# Altium project PCB_Project.PrjPcb
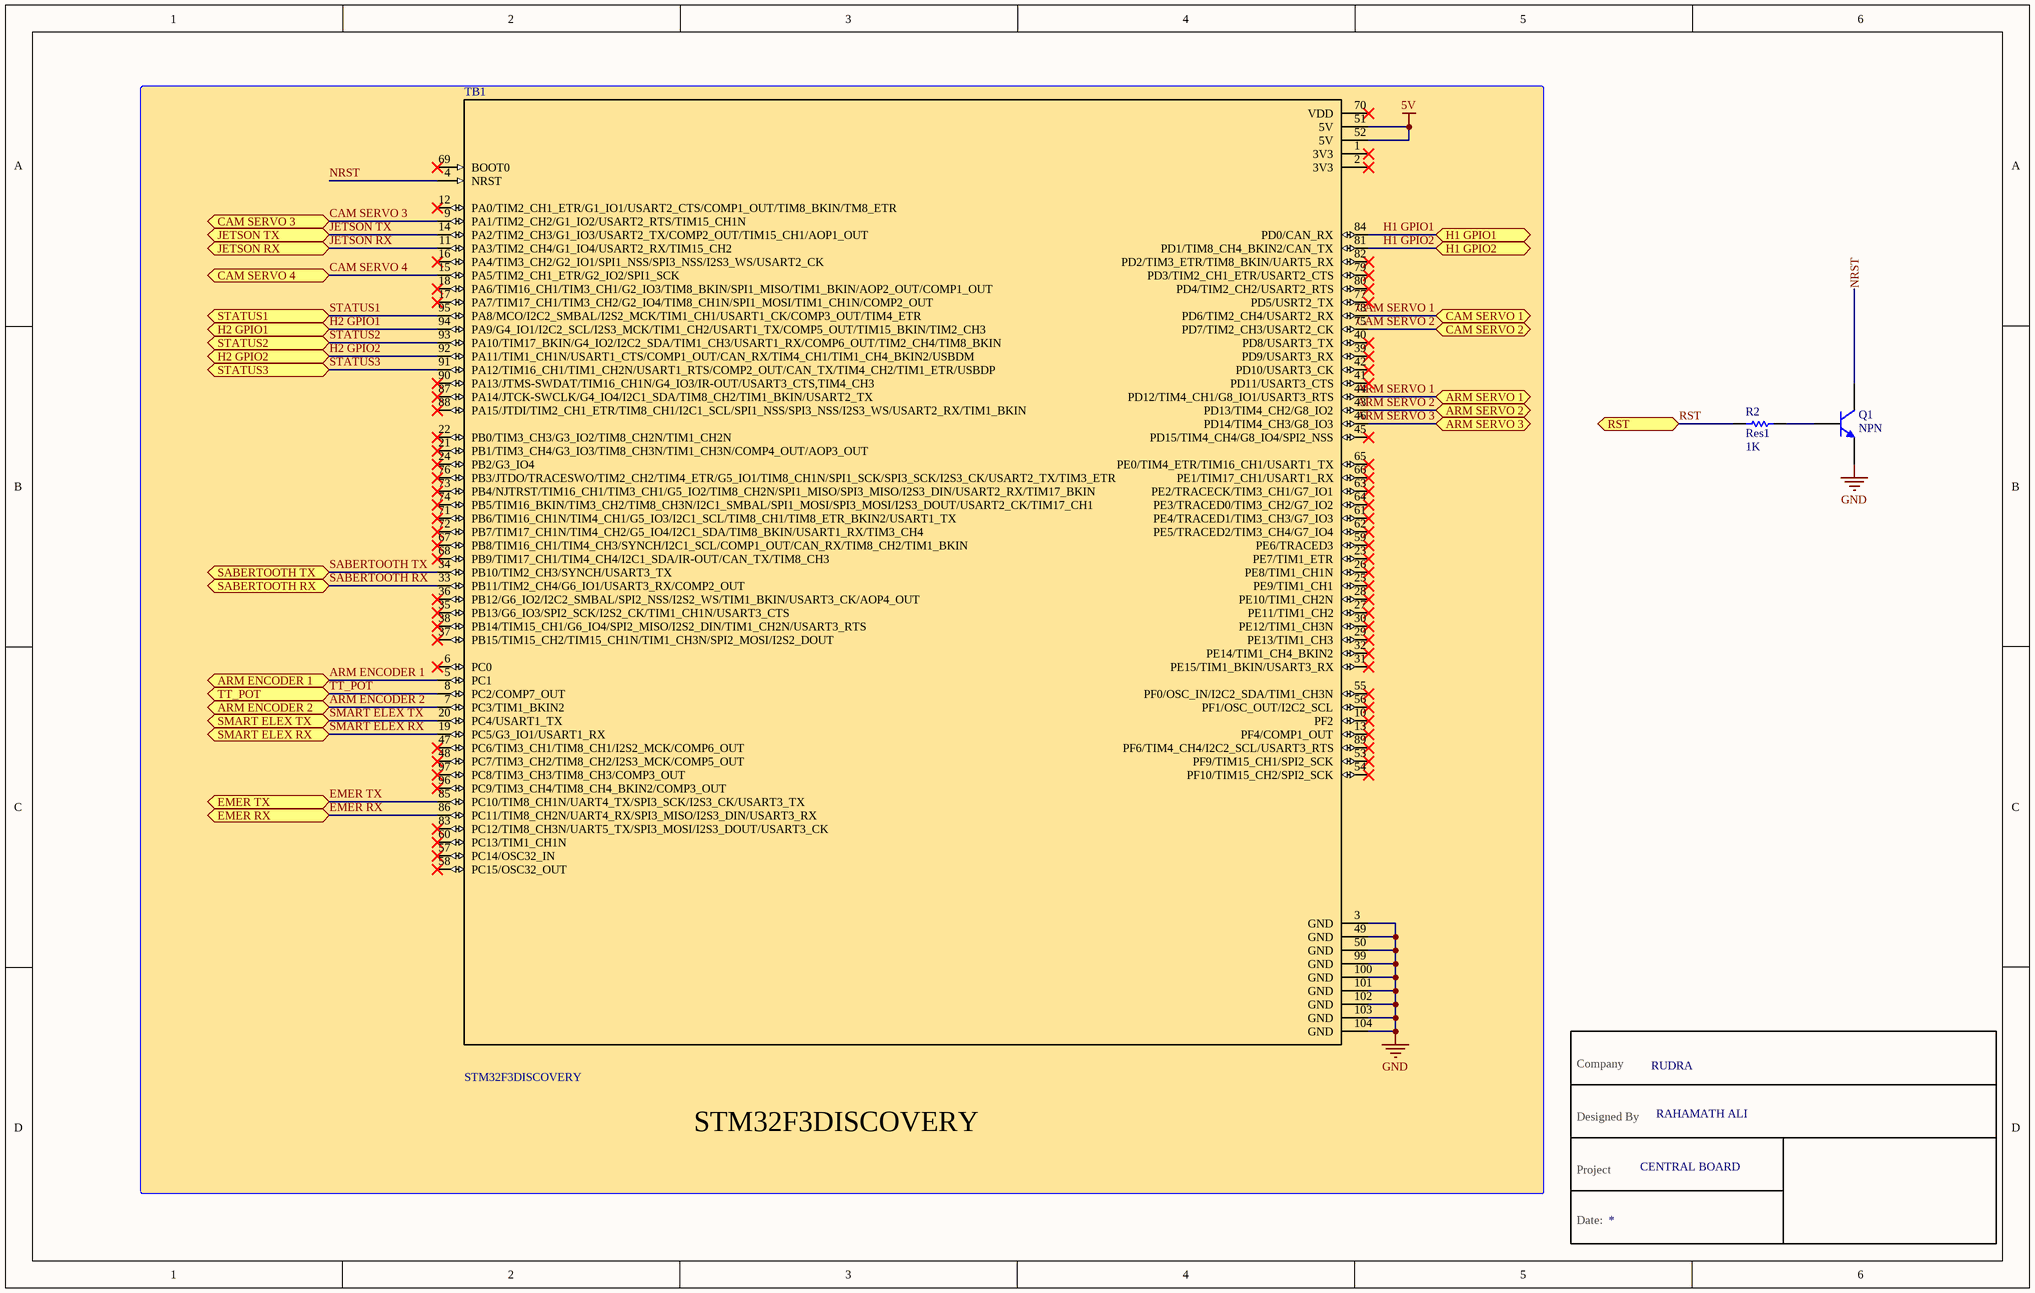
[diagram p0: STM32 BOARD.SchDoc]
Company: RUDRA
3 sheets, 35 parts. Net scope: flat (ports and power ports of the same name join across sheets).
Board file: PCB2.PcbDoc
Sheets:
  STM32 BOARD.SchDoc
  POE+POWER+SERVO+CAMERA.SchDoc
  ARM+SERVO+I O.SchDoc

## Sheet STM32 BOARD.SchDoc
size B

### Parts
1  Project: CENTRAL BOARD  Designed By: RAHAMATH ALI  Company: RUDRA  (hidden comment: Schematic Table)  (graphical)
Q1  NPN  [TO-226-AA]
R2  Res1  value 1K  [AXIAL-0.3]
TB1  STM32F3DISCOVERY  [SHIELD_STM32F3DISCOVERY]

### Blocks framed on the sheet
STM32F3DISCOVERY: TB1

### Ports
ARM ENCODER 1 (bidir), ARM ENCODER 2 (bidir), ARM SERVO 1 (bidir), ARM SERVO 2 (bidir), ARM SERVO 3 (bidir), CAM SERVO 1 (bidir), CAM SERVO 2 (bidir), CAM SERVO 3 (bidir), CAM SERVO 4 (bidir), EMER RX (bidir), EMER TX (bidir), H1 GPIO1 (bidir), H1 GPIO2 (bidir), H2 GPIO1 (bidir), H2 GPIO2 (bidir), JETSON RX (bidir), JETSON TX (bidir), RST (bidir), SABERTOOTH RX (bidir), SABERTOOTH TX (bidir), SMART ELEX RX (bidir), SMART ELEX TX (bidir), STATUS1 (bidir), STATUS2 (bidir), STATUS3 (bidir), TT_POT (bidir)

### Nets
5V: TB1.51(5V) TB1.52(5V)
GND: Q1.3(E) TB1.3(GND) TB1.49(GND) TB1.50(GND) TB1.99(GND) TB1.100(GND) TB1.101(GND) TB1.102(GND) TB1.103(GND) TB1.104(GND)
ARM ENCODER 1: TB1.5(PC1) ; port ARM ENCODER 1
ARM ENCODER 2: TB1.7(PC3/TIM1_BKIN2) ; port ARM ENCODER 2
ARM SERVO 1: TB1.44(PD12/TIM4_CH1/G8_IO1/USART3_RTS) ; port ARM SERVO 1
ARM SERVO 2: TB1.43(PD13/TIM4_CH2/G8_IO2) ; port ARM SERVO 2
ARM SERVO 3: TB1.46(PD14/TIM4_CH3/G8_IO3) ; port ARM SERVO 3
CAM SERVO 1: TB1.78(PD6/TIM2_CH4/USART2_RX) ; port CAM SERVO 1
CAM SERVO 2: TB1.75(PD7/TIM2_CH3/USART2_CK) ; port CAM SERVO 2
CAM SERVO 3: TB1.9(PA1/TIM2_CH2/G1_IO2/USART2_RTS/TIM15_CH1N) ; port CAM SERVO 3
CAM SERVO 4: TB1.15(PA5/TIM2_CH1_ETR/G2_IO2/SPI1_SCK) ; port CAM SERVO 4
EMER RX: TB1.86(PC11/TIM8_CH2N/UART4_RX/SPI3_MISO/I2S3_DIN/USART3_RX) ; port EMER RX
EMER TX: TB1.85(PC10/TIM8_CH1N/UART4_TX/SPI3_SCK/I2S3_CK/USART3_TX) ; port EMER TX
H1 GPIO1: TB1.84(PD0/CAN_RX) ; port H1 GPIO1
H1 GPIO2: TB1.81(PD1/TIM8_CH4_BKIN2/CAN_TX) ; port H1 GPIO2
H2 GPIO1: TB1.94(PA9/G4_IO1/I2C2_SCL/I2S3_MCK/TIM1_CH2/USART1_TX/COMP5_OUT/TIM15_BKIN/TIM2_CH3) ; port H2 GPIO1
H2 GPIO2: TB1.92(PA11/TIM1_CH1N/USART1_CTS/COMP1_OUT/CAN_RX/TIM4_CH1/TIM1_CH4_BKIN2/USBDM) ; port H2 GPIO2
JETSON RX: TB1.11(PA3/TIM2_CH4/G1_IO4/USART2_RX/TIM15_CH2) ; port JETSON RX
JETSON TX: TB1.14(PA2/TIM2_CH3/G1_IO3/USART2_TX/COMP2_OUT/TIM15_CH1/AOP1_OUT) ; port JETSON TX
NRST: Q1.1(C) TB1.4(NRST)
RST: R2.1 ; port RST
SABERTOOTH RX: TB1.33(PB11/TIM2_CH4/G6_IO1/USART3_RX/COMP2_OUT) ; port SABERTOOTH RX
SABERTOOTH TX: TB1.34(PB10/TIM2_CH3/SYNCH/USART3_TX) ; port SABERTOOTH TX
SMART ELEX RX: TB1.19(PC5/G3_IO1/USART1_RX) ; port SMART ELEX RX
SMART ELEX TX: TB1.20(PC4/USART1_TX) ; port SMART ELEX TX
STATUS1: TB1.95(PA8/MCO/I2C2_SMBAL/I2S2_MCK/TIM1_CH1/USART1_CK/COMP3_OUT/TIM4_ETR) ; port STATUS1
STATUS2: TB1.93(PA10/TIM17_BKIN/G4_IO2/I2C2_SDA/TIM1_CH3/USART1_RX/COMP6_OUT/TIM2_CH4/TIM8_BKIN) ; port STATUS2
STATUS3: TB1.91(PA12/TIM16_CH1/TIM1_CH2N/USART1_RTS/COMP2_OUT/CAN_TX/TIM4_CH2/TIM1_ETR/USBDP) ; port STATUS3
TT_POT: TB1.8(PC2/COMP7_OUT) ; port TT_POT
NetQ1_2: Q1.2(B) R2.2

Not connected (* = marked no-connect by the designer): TB1 1(3V3)* 2(3V3)* 6(PC0)* 10(PF2)* 12(PA0/TIM2_CH1_ETR/G1_IO1/USART2_CTS/COMP1_OUT/TIM8_BKIN/TM8_ETR)* 13(PF4/COMP1_OUT)* 16(PA4/TIM3_CH2/G2_IO1/SPI1_NSS/SPI3_NSS/I2S3_WS/USART2_CK)* 17(PA7/TIM17_CH1/TIM3_CH2/G2_IO4/TIM8_CH1N/SPI1_MOSI/TIM1_CH1N/COMP2_OUT)* 18(PA6/TIM16_CH1/TIM3_CH1/G2_IO3/TIM8_BKIN/SPI1_MISO/TIM1_BKIN/AOP2_OUT/COMP1_OUT)* 21(PB1/TIM3_CH4/G3_IO3/TIM8_CH3N/TIM1_CH3N/COMP4_OUT/AOP3_OUT)* 22(PB0/TIM3_CH3/G3_IO2/TIM8_CH2N/TIM1_CH2N)* 23(PE7/TIM1_ETR)* 24(PB2/G3_IO4)* 25(PE9/TIM1_CH1)* 26(PE8/TIM1_CH1N)* 27(PE11/TIM1_CH2)* 28(PE10/TIM1_CH2N)* 29(PE13/TIM1_CH3)* 30(PE12/TIM1_CH3N)* 31(PE15/TIM1_BKIN/USART3_RX)* 32(PE14/TIM1_CH4_BKIN2)* 35(PB13/G6_IO3/SPI2_SCK/I2S2_CK/TIM1_CH1N/USART3_CTS)* 36(PB12/G6_IO2/I2C2_SMBAL/SPI2_NSS/I2S2_WS/TIM1_BKIN/USART3_CK/AOP4_OUT)* 37(PB15/TIM15_CH2/TIM15_CH1N/TIM1_CH3N/SPI2_MOSI/I2S2_DOUT)* 38(PB14/TIM15_CH1/G6_IO4/SPI2_MISO/I2S2_DIN/TIM1_CH2N/USART3_RTS)* 39(PD9/USART3_RX)* 40(PD8/USART3_TX)* 41(PD11/USART3_CTS)* 42(PD10/USART3_CK)* 45(PD15/TIM4_CH4/G8_IO4/SPI2_NSS)* 47(PC6/TIM3_CH1/TIM8_CH1/I2S2_MCK/COMP6_OUT)* 48(PC7/TIM3_CH2/TIM8_CH2/I2S3_MCK/COMP5_OUT)* 53(PF9/TIM15_CH1/SPI2_SCK)* 54(PF10/TIM15_CH2/SPI2_SCK)* 55(PF0/OSC_IN/I2C2_SDA/TIM1_CH3N)* 56(PF1/OSC_OUT/I2C2_SCL)* 57(PC14/OSC32_IN)* 58(PC15/OSC32_OUT)* 59(PE6/TRACED3)* 60(PC13/TIM1_CH1N)* 61(PE4/TRACED1/TIM3_CH3/G7_IO3)* 62(PE5/TRACED2/TIM3_CH4/G7_IO4)* 63(PE2/TRACECK/TIM3_CH1/G7_IO1)* 64(PE3/TRACED0/TIM3_CH2/G7_IO2)* 65(PE0/TIM4_ETR/TIM16_CH1/USART1_TX)* 66(PE1/TIM17_CH1/USART1_RX)* 67(PB8/TIM16_CH1/TIM4_CH3/SYNCH/I2C1_SCL/COMP1_OUT/CAN_RX/TIM8_CH2/TIM1_BKIN)* 68(PB9/TIM17_CH1/TIM4_CH4/I2C1_SDA/IR-OUT/CAN_TX/TIM8_CH3)* 69(BOOT0)* 70(VDD)* 71(PB6/TIM16_CH1N/TIM4_CH1/G5_IO3/I2C1_SCL/TIM8_CH1/TIM8_ETR_BKIN2/USART1_TX)* 72(PB7/TIM17_CH1N/TIM4_CH2/G5_IO4/I2C1_SDA/TIM8_BKIN/USART1_RX/TIM3_CH4)* 73(PB4/NJTRST/TIM16_CH1/TIM3_CH1/G5_IO2/TIM8_CH2N/SPI1_MISO/SPI3_MISO/I2S3_DIN/USART2_RX/TIM17_BKIN)* 74(PB5/TIM16_BKIN/TIM3_CH2/TIM8_CH3N/I2C1_SMBAL/SPI1_MOSI/SPI3_MOSI/I2S3_DOUT/USART2_CK/TIM17_CH1)* 76(PB3/JTDO/TRACESWO/TIM2_CH2/TIM4_ETR/G5_IO1/TIM8_CH1N/SPI1_SCK/SPI3_SCK/I2S3_CK/USART2_TX/TIM3_ETR)* 77(PD5/USRT2_TX)* 79(PD3/TIM2_CH1_ETR/USART2_CTS)* 80(PD4/TIM2_CH2/USART2_RTS)* 82(PD2/TIM3_ETR/TIM8_BKIN/UART5_RX)* 83(PC12/TIM8_CH3N/UART5_TX/SPI3_MOSI/I2S3_DOUT/USART3_CK)* 87(PA14/JTCK-SWCLK/G4_IO4/I2C1_SDA/TIM8_CH2/TIM1_BKIN/USART2_TX)* 88(PA15/JTDI/TIM2_CH1_ETR/TIM8_CH1/I2C1_SCL/SPI1_NSS/SPI3_NSS/I2S3_WS/USART2_RX/TIM1_BKIN)* 89(PF6/TIM4_CH4/I2C2_SCL/USART3_RTS)* 90(PA13/JTMS-SWDAT/TIM16_CH1N/G4_IO3/IR-OUT/USART3_CTS,TIM4_CH3)* 96(PC9/TIM3_CH4/TIM8_CH4_BKIN2/COMP3_OUT)* 97(PC8/TIM3_CH3/TIM8_CH3/COMP3_OUT)*

### Notes on the sheet
- (in symbol Schematic Table) Company; Designed By; Project; Date:

### Library data of the parts
Q1 = NPN: NPN Bipolar Transistor; Published: 8-Jun-2000; LatestRevisionDate: 17-Jul-2002; LatestRevisionNote: Re-released for DXP Platform.; PackageReference: TO-226-AA; Publisher: Altium Limited; PackageDescription: TO, Flat Index; 3 In-Line, Axial Leads; Body Dia. 4.8mm; Leads 0.55 x 0.51 mm (max); Code_JEDEC: TO-226-AA
R2 = Res1: Resistor; Published: 8-Jun-2000; LatestRevisionDate: 17-Jul-2002; LatestRevisionNote: Re-released for DXP Platform.; PackageReference: AXIAL-0.3; Publisher: Altium Limited; PackageDescription: Axial Device, Thru-Hole; 2 Leads; 0.3 in Pin Spacing
TB1 = STM32F3DISCOVERY: / STM32F303VCT6 Discovery STM32F3 ARMÂ® CortexÂ®-M4 MCU 32-Bit Embedded Evaluation Board /; MF: STMicroelectronics; Price: None; MP: STM32F3DISCOVERY; Package: LQFP-100 STMicroelectronics; SnapEDA_Link: https://www.snapeda.com/parts/STM32F3DISCOVERY/STMicroelectronics/view-part/10815/?ref=snap; Availability: Unavailable; Value: *

## Sheet POE+POWER+SERVO+CAMERA.SchDoc
size A
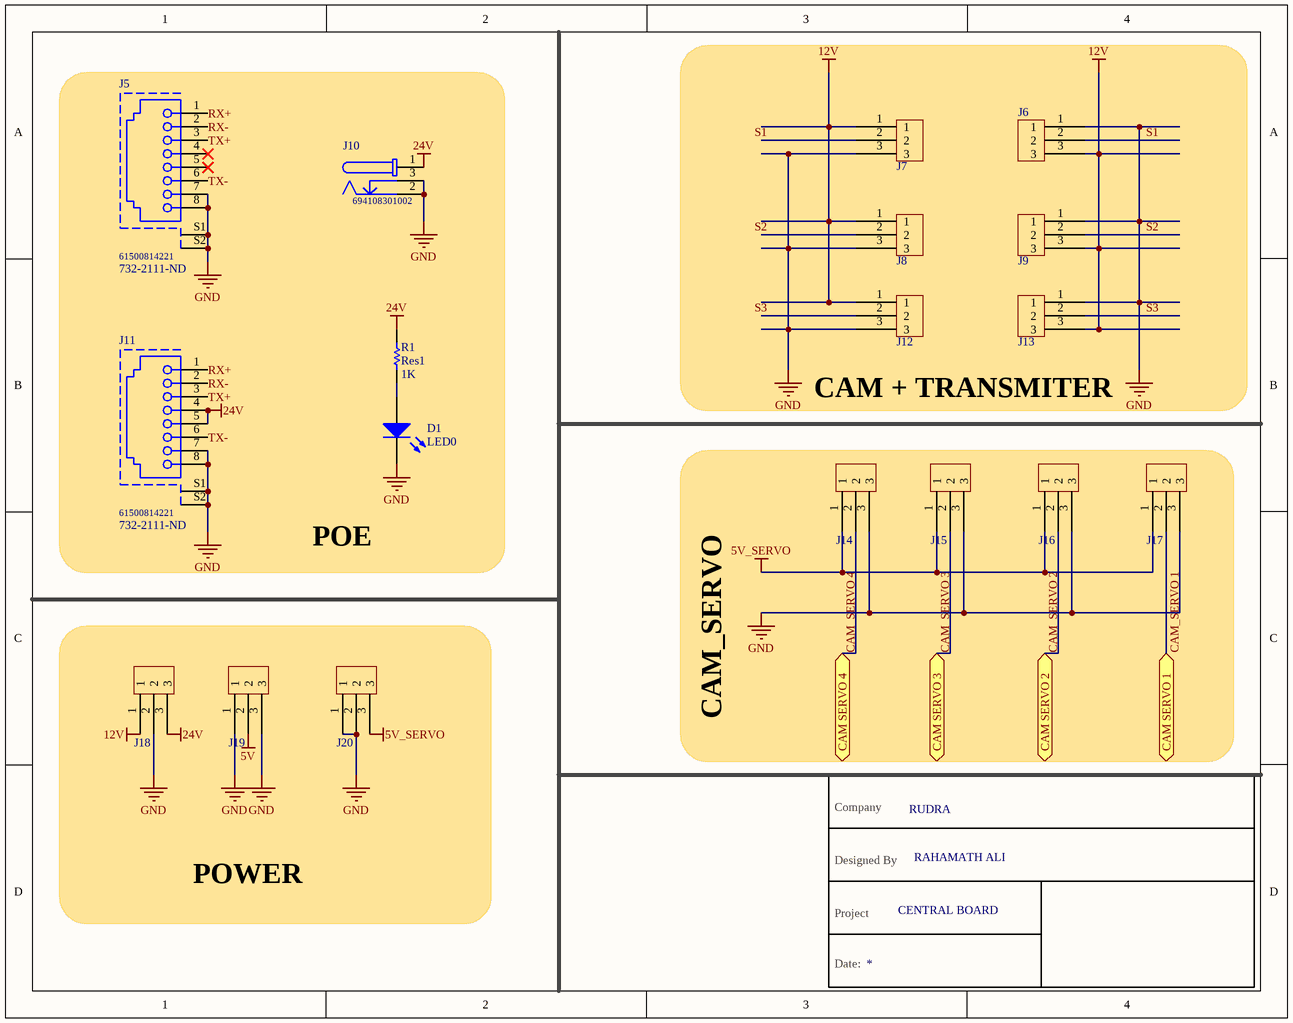
[diagram p1: POE+POWER+SERVO+CAMERA.SchDoc]

### Parts
(Parts that share a designator on the sheet are numbered #1, #2 ... from top to bottom, then left to right.)
?#1  Project: CENTRAL BOARD  Designed By: RAHAMATH ALI  Company: RUDRA  (hidden comment: Schematic Table)  (graphical)
D1  LED0  [LED-0]
J5  61500814221  Supplier Part Number 1: 732-2111-ND  [61500814221]
J6  3 PIN GREEN  [PHOENIX_MSTBA_2,5_3-G-5,08_1757255]  (value not drawn)
J7  3 PIN GREEN  [PHOENIX_MSTBA_2,5_3-G-5,08_1757255]  (value not drawn)
J8  3 PIN GREEN  [PHOENIX_MSTBA_2,5_3-G-5,08_1757255]  (value not drawn)
J9  3 PIN GREEN  [PHOENIX_MSTBA_2,5_3-G-5,08_1757255]  (value not drawn)
J10  694108301002  [694108301002]
J11  61500814221  Supplier Part Number 1: 732-2111-ND  [61500814221]
J12  3 PIN GREEN  [PHOENIX_MSTBA_2,5_3-G-5,08_1757255]  (value not drawn)
J13  3 PIN GREEN  [PHOENIX_MSTBA_2,5_3-G-5,08_1757255]  (value not drawn)
J14  3 PIN GREEN  [PHOENIX_MSTBA_2,5_3-G-5,08_1757255]  (value not drawn)
J15  3 PIN GREEN  [PHOENIX_MSTBA_2,5_3-G-5,08_1757255]  (value not drawn)
J16  3 PIN GREEN  [PHOENIX_MSTBA_2,5_3-G-5,08_1757255]  (value not drawn)
J17  3 PIN GREEN  [PHOENIX_MSTBA_2,5_3-G-5,08_1757255]  (value not drawn)
J18  3 PIN GREEN  [PHOENIX_MSTBA_2,5_3-G-5,08_1757255]  (value not drawn)
J19  3 PIN GREEN  [PHOENIX_MSTBA_2,5_3-G-5,08_1757255]  (value not drawn)
J20  3 PIN GREEN  [PHOENIX_MSTBA_2,5_3-G-5,08_1757255]  (value not drawn)
R1  Res1  value 1K  [AXIAL-0.3]

### Blocks framed on the sheet
POE: D1 J5 J10 J11 R1
CAM + TRANSMITER: J6-J9 J12 J13
CAM_SERVO: J14-J17
POWER: J18-J20

### Ports
CAM SERVO 1 (bidir), CAM SERVO 2 (bidir), CAM SERVO 3 (bidir), CAM SERVO 4 (bidir)

### Nets
5V: J19.2
5V_SERVO: J14.1 J15.1 J16.1 J17.1 J20.3
12V: J6.3 J7.1 J8.1 J9.3 J12.1 J13.3 J18.1
24V: J10.1 J11.4 J11.5 J18.3 R1.2
GND: D1.2(K) J5.7 J5.8 J5.S1 J5.S2 J6.1 J7.3 J8.3 J9.1 J10.2 J10.3 J11.7 J11.8 J11.S1 J11.S2 J12.3 J13.1 J14.3 J15.3 J16.3 J17.3 J18.2 J19.1 J19.3 J20.1 J20.2
CAM_SERVO 1: J17.2 ; port CAM SERVO 1  [project net CAM SERVO 1]
CAM_SERVO 2: J16.2 ; port CAM SERVO 2  [project net CAM SERVO 2]
CAM_SERVO 3: J15.2 ; port CAM SERVO 3  [project net CAM SERVO 3]
CAM_SERVO 4: J14.2 ; port CAM SERVO 4  [project net CAM SERVO 4]
RX+: J5.1 J11.1
RX-: J5.2 J11.2
S1: J6.2 J7.2
S2: J8.2 J9.2
S3: J12.2 J13.2
TX+: J5.3 J11.3
TX-: J5.6 J11.6
NetD1_1: D1.1(A) R1.1

Not connected (* = marked no-connect by the designer): J5 4* 5*

### Notes on the sheet
- (in symbol Schematic Table) Company; Designed By; Project; Date:

### Library data of the parts
D1 = LED0: Typical INFRARED GaAs LED; Published: 8-Jun-2000; LatestRevisionDate: 08-Jul-2005; LatestRevisionNote: Mech Layer 1 removed.; PackageReference: LED-0; Publisher: Altium Limited; PackageDescription: LED; 2 Leads
J5 J11 = RJ45: Modular Jack WR-MJ, Tab Down, Shielded, Horizontal Entry, THT, 8P8C; Manufacturer: Wurth Elektronik; Manufacturer 1: Wurth Electronics; Withstanding Voltage: 1000VAC; Contact Resistance: 20mOhm; Rated Current: 1.5A; Compliance: Leadfree/RoHS; Port: 1x1; Working Voltage: 120VAC; Connector Type: Jack,RJ45,Socket; Number of Ports: 1; Number of Contacts: 8; Gender: Female; Mating Cycles: 500; Insulation Resistance: 500MR; Voltage Rating (AC): 120V; Entrance: Horizontal; Package Reference: 61500814221; Datasheet URL: https://katalog.we-online.de/em/datasheet/61500814221.pdf; Pin Number: 8P8C; Operating Temperature: -40to85degC; Manufacturer URL: http://www.we-online.de; Packaging: Tray; Publisher: WurthElektronik; Part Number: 61500814221; Mounting Technology: THT; Supplier 1: Digi-Key; Manufacturer Part Number 1: 61500814221; Stock 1: 262; Pricing 1: 1=2.38000, 10=2.33000, 50=2.24000, 100=2.15000, 500=2.06100 (USD); RoHS: Yes; Mount: Through Hole,PCB; Contact Plating: Gold; Contact Material: Copper Alloy,Copper; Housing Material: PBT; Color: Black; Min Operating Temperature: -40°C; Max Operating Temperature: 85°C; Termination: Through Hole; Shielding: Shielded; Number of Positions: 8; Package Quantity: 80; Number of Rows: 1; Direction: Down; Orientation: Right Angle; Current Rating: 1.5A; Length: 13.65mm; Height: 19.95mm; Depth: 21.2mm; Width: 15.88mm; REACH SVHC: Unknown; Flammability Rating: UL94 V-0; ComponentLink1URL: https://datasheet.ciiva.com/1108/76605-1108145.pdf?src-supplier=Element14; ComponentLink1Description: https://datasheet.ciiva.com/1108/76605-1108145.pdf?src-supplier=Element14; ComponentLink2URL: https://datasheet.ciiva.com/4561/61500814221-78459-4561634.pdf?src-supplier=Mouser; ComponentLink2Description: https://datasheet.ciiva.com/4561/61500814221-78459-4561634.pdf?src-supplier=Mouser; ComponentLink3URL: https://datasheet.ciiva.com/686/61500814221-686710.pdf?src-supplier=Digi-Key; ComponentLink3Description: https://datasheet.ciiva.com/686/61500814221-686710.pdf?src-supplier=Digi-Key; ComponentLink4URL: https://datasheet.ciiva.com/11726/0900766b80f88678-11726201.pdf?src-supplier=RSComponents; ComponentLink4Description: https://datasheet.ciiva.com/11726/0900766b80f88678-11726201.pdf?src-supplier=RSComponents; ComponentLink5URL: https://datasheet.ciiva.com/48689/001088220-da-01-en-wr-com-modular-jack-61500814221-48689546.pdf?src-supplier=Conrad; ComponentLink5Description: https://datasheet.ciiva.com/48689/001088220-da-01-en-wr-com-modular-jack-61500814221-48689546.pdf?src-supplier=Conrad
J6-J9 J12-J20 = 3 PIN GREEN: Manufacturer 1: Phoenix Contact; Manufacturer Part Number 1: 1757255; Current Rating: 12A; Voltage Rating: 250V; Voltage Rating (DC): 320V; Number of Poles: 3; Number of Levels: 1; Current: 15A; Voltage: 300V; Connector Type: Plug; Gender: Male; Pitch: 5.08mm; Approvals: UL,CSA,VDE,EN; Supplier 1: Digi-Key; Stock 1: 4025; Pricing 1: 1=1.03000, 10=0.99000, 50=0.94720, 100=0.92130, 250=0.86100, 500=0.79212, 1000=0.73185, 2500=0.69741, 5000=0.65436 (USD); RoHS: Yes; Mount: Through Hole; Weight: 5.396916oz; Color: Grey,Green; Contact Plating: Tin; Housing Color: Green; Housing Material: Polybutylene; Contact Material: Tin; Package Quantity: 50; Packaging: Bulk; Termination: Solder; Max Current Rating: 12A; Number of Rows: 1; Number of Positions: 3; Number of Positions Per Level: 3; Number of Contacts: 3; Orientation: Right Angle; Length: 17.24mm; Height: 12.1mm; Depth: 12mm; Width: 17.16mm; Lead Free: Lead Free; Flammability Rating: UL94 V-0; REACH SVHC: No SVHC; ComponentLink1URL: https://datasheet.ciiva.com/15197/getdatasheetpartid-176351-15197329.pdf?src-supplier=Verical; ComponentLink1Description: https://datasheet.ciiva.com/15197/getdatasheetpartid-176351-15197329.pdf?src-supplier=Verical; ComponentLink2URL: https://datasheet.ciiva.com/16096/1757255-16096404.pdf?src-supplier=Onlinecomponents.com; ComponentLink2Description: https://datasheet.ciiva.com/16096/1757255-16096404.pdf?src-supplier=Onlinecomponents.com; ComponentLink3URL: https://datasheet.ciiva.com/7630/1697152-7630840.pdf?src-supplier=Element14; ComponentLink3Description: https://datasheet.ciiva.com/7630/1697152-7630840.pdf?src-supplier=Element14; ComponentLink4URL: https://datasheet.ciiva.com/795/1757255-795421.pdf?src-supplier=Digi-Key; ComponentLink4Description: https://datasheet.ciiva.com/795/1757255-795421.pdf?src-supplier=Digi-Key; ComponentLink5URL: https://datasheet.ciiva.com/29210/569707-da-01-en-grundgehaeuse-1757255-250-st-29210878.pdf?src-supplier=Conrad; ComponentLink5Description: https://datasheet.ciiva.com/29210/569707-da-01-en-grundgehaeuse-1757255-250-st-29210878.pdf?src-supplier=Conrad; Supplier Part Number 1: 277-1107-ND
J10 = DC POWER JACK: DC Power Jack Connector WR-DC, Male, Right Angled, THT, 5 A, 24 V; Manufacturer: Wurth Elektronik; Rated Current: 5A; Plug Inner Diameter: 2.55mm; Plug Outer Diameter: 5.5mm; Working Voltage: 24V; Opening Diameter: 6.4mm; Publisher: WurthElektronik; Orientation: RightAngled; Part Number: 694108301002; Manufacturer URL: http://www.we-online.de; Mounting Technology: THT; Packaging: Bag; Datasheet URL: http://katalog.we-online.de/em/datasheet/6941xx301002.pdf; Operating Temperature: -40to85degC; Package Reference: 694108301002; Gender: Male
R1 = Res1: Resistor; Published: 8-Jun-2000; LatestRevisionDate: 17-Jul-2002; LatestRevisionNote: Re-released for DXP Platform.; PackageReference: AXIAL-0.3; Publisher: Altium Limited; PackageDescription: Axial Device, Thru-Hole; 2 Leads; 0.3 in Pin Spacing

## Sheet ARM+SERVO+I O.SchDoc
size A
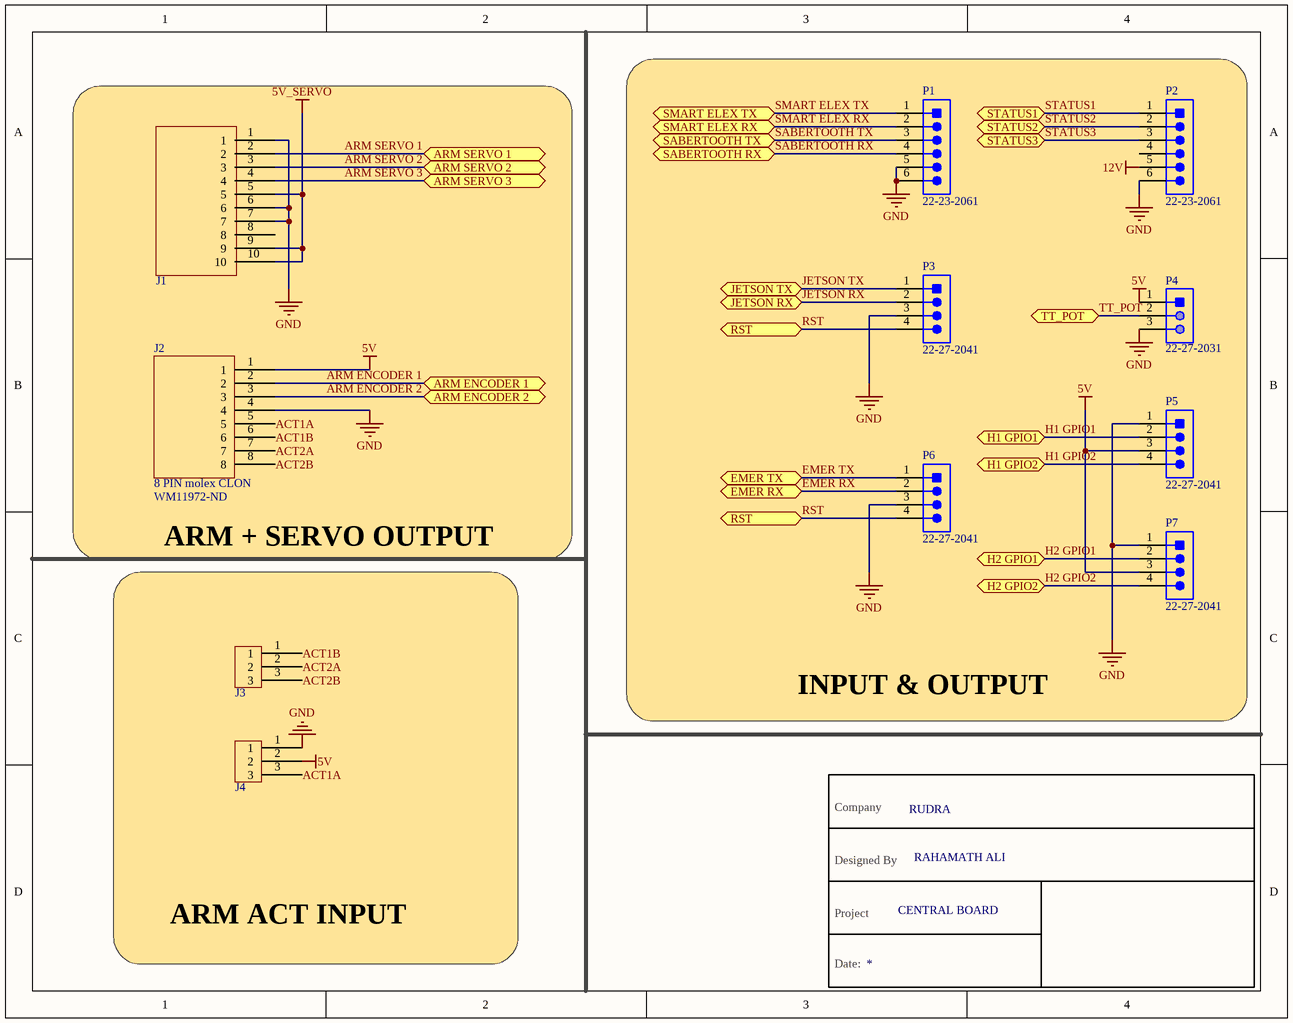
[diagram p2: ARM+SERVO+I O.SchDoc]

### Parts
(Parts that share a designator on the sheet are numbered #1, #2 ... from top to bottom, then left to right.)
?#2  Project: CENTRAL BOARD  Designed By: RAHAMATH ALI  Company: RUDRA  (hidden comment: Schematic Table)  (graphical)
J1  10 PIN MOLEX CLON  [10 pin molex]  (value not drawn)
J2  8 PIN molex CLON  Supplier Part Number 1: WM11972-ND  [8 PIN MOLEX CLON]
J3  3 PIN GREEN  [PHOENIX_MSTBA_2,5_3-G-5,08_1757255]  (value not drawn)
J4  3 PIN GREEN  [PHOENIX_MSTBA_2,5_3-G-5,08_1757255]  (value not drawn)
P1  22-23-2061  [MOLX-22-23-2061_V]
P2  22-23-2061  [MOLX-22-23-2061_V]
P3  22-27-2041  [MOLX-22-27-2041_V]
P4  22-27-2031  [MOLX-22-27-2031_V]
P5  22-27-2041  [MOLX-22-27-2041_V]
P6  22-27-2041  [MOLX-22-27-2041_V]
P7  22-27-2041  [MOLX-22-27-2041_V]

### Blocks framed on the sheet
INPUT & OUTPUT: P1-P7
ARM + SERVO OUTPUT: J1 J2
ARM ACT INPUT: J3 J4

### Ports
ARM ENCODER 1 (bidir), ARM ENCODER 2 (bidir), ARM SERVO 1 (bidir), ARM SERVO 2 (bidir), ARM SERVO 3 (bidir), EMER RX (bidir), EMER TX (bidir), H1 GPIO1 (bidir), H1 GPIO2 (bidir), H2 GPIO1 (bidir), H2 GPIO2 (bidir), JETSON RX (bidir), JETSON TX (bidir), RST (bidir), SABERTOOTH RX (bidir), SABERTOOTH TX (bidir), SMART ELEX RX (bidir), SMART ELEX TX (bidir), STATUS1 (bidir), STATUS2 (bidir), STATUS3 (bidir), TT_POT (bidir)

### Nets
5V: J2.1 J4.2 P4.1 P5.3 P7.3
5V_SERVO: J1.5 J1.9 J1.10
12V: P2.5
GND: J1.1 J1.6 J1.7 J2.4 J4.1 P1.5 P1.6 P2.6 P3.3 P4.3 P5.1 P6.3 P7.1
ACT1A: J2.5 J4.3
ACT1B: J2.6 J3.1
ACT2A: J2.7 J3.2
ACT2B: J2.8 J3.3
ARM ENCODER 1: J2.2 ; port ARM ENCODER 1
ARM ENCODER 2: J2.3 ; port ARM ENCODER 2
ARM SERVO 1: J1.2 ; port ARM SERVO 1
ARM SERVO 2: J1.3 ; port ARM SERVO 2
ARM SERVO 3: J1.4 ; port ARM SERVO 3
EMER RX: P6.2 ; port EMER RX
EMER TX: P6.1 ; port EMER TX
H1 GPIO1: P5.2 ; port H1 GPIO1
H1 GPIO2: P5.4 ; port H1 GPIO2
H2 GPIO1: P7.2 ; port H2 GPIO1
H2 GPIO2: P7.4 ; port H2 GPIO2
JETSON RX: P3.2 ; port JETSON RX
JETSON TX: P3.1 ; port JETSON TX
RST: P3.4 P6.4 ; port RST
SABERTOOTH RX: P1.4 ; port SABERTOOTH RX
SABERTOOTH TX: P1.3 ; port SABERTOOTH TX
SMART ELEX RX: P1.2 ; port SMART ELEX RX
SMART ELEX TX: P1.1 ; port SMART ELEX TX
STATUS1: P2.1 ; port STATUS1
STATUS2: P2.2 ; port STATUS2
STATUS3: P2.3 ; port STATUS3
TT_POT: P4.2 ; port TT_POT

Not connected (* = marked no-connect by the designer): J1 8; P2 4

### Notes on the sheet
- (in symbol Schematic Table) Company; Designed By; Project; Date:

### Library data of the parts
J2 = 8 PIN molex CLON: Manufacturer Part Number 1: 76825-0008; Number of Circuits: 8; Gender: Male; Pitch: 5.7mm; Supplier 1: Digi-Key; Manufacturer 1: Molex; Stock 1: 794; Pricing 1: 1=2.83000, 10=2.72000, 25=2.49360, 50=2.38040, 100=2.26700, 250=1.98364, 672=1.92695, 1344=1.64357, 2688=1.53022 (USD); RoHS: Yes; Mount: Through Hole; Number of Pins: 8; Color: Black; Contact Plating: Tin; Contact Material: Copper; Termination: Through Hole; Number of Rows: 2; Orientation: Right Angle; Number of Contacts: 8; REACH SVHC: Unknown; ComponentLink1URL: http://www.alliedelec.com/images/products/datasheets/bm/BrandonData/70717241.pdf?src-supplier=Allied+Electronics; ComponentLink1Description: http://www.alliedelec.com/images/products/datasheets/bm/BrandonData/70717241.pdf?src-supplier=Allied+Electronics; ComponentLink2URL: http://www.farnell.com/datasheets/2216656.pdf?src-supplier=Farnell; ComponentLink2Description: http://www.farnell.com/datasheets/2216656.pdf?src-supplier=Farnell; ComponentLink3URL: http://www.farnell.com/datasheets/1968956.pdf?src-supplier=Element14; ComponentLink3Description: http://www.farnell.com/datasheets/1968956.pdf?src-supplier=Element14; ComponentLink4URL: http://www.farnell.com/datasheets/2001779.pdf?src-supplier=Element14; ComponentLink4Description: http://www.farnell.com/datasheets/2001779.pdf?src-supplier=Element14; ComponentLink5URL: http://www.farnell.com/datasheets/2216656.pdf?src-supplier=Newark; ComponentLink5Description: http://www.farnell.com/datasheets/2216656.pdf?src-supplier=Newark; ComponentLink6URL: https://www.molex.com/pdm_docs/sd/768250008_sd.pdf?src-supplier=Digi-Key; ComponentLink6Description: https://www.molex.com/pdm_docs/sd/768250008_sd.pdf?src-supplier=Digi-Key
J3 J4 = 3 PIN GREEN: as J6 on sheet POE+POWER+SERVO+CAMERA; Supplier 1: Digi-Key; Stock 1: 4025; Pricing 1: 1=1.03000, 10=0.99000, 50=0.94720, 100=0.92130, 250=0.86100, 500=0.79212, 1000=0.73185, 2500=0.69741, 5000=0.65436 (USD); RoHS: Yes; Mount: Through Hole; Weight: 5.396916oz; Color: Grey,Green; Contact Plating: Tin; Housing Color: Green; Housing Material: Polybutylene; Contact Material: Tin; Package Quantity: 50; Packaging: Bulk; Termination: Solder; Max Current Rating: 12A; Number of Rows: 1; Number of Positions: 3; Number of Positions Per Level: 3; Number of Contacts: 3; Orientation: Right Angle; Length: 17.24mm; Height: 12.1mm; Depth: 12mm; Width: 17.16mm; Lead Free: Lead Free; Flammability Rating: UL94 V-0; REACH SVHC: No SVHC; ComponentLink1URL: https://datasheet.ciiva.com/15197/getdatasheetpartid-176351-15197329.pdf?src-supplier=Verical; ComponentLink1Description: https://datasheet.ciiva.com/15197/getdatasheetpartid-176351-15197329.pdf?src-supplier=Verical; ComponentLink2URL: https://datasheet.ciiva.com/16096/1757255-16096404.pdf?src-supplier=Onlinecomponents.com; ComponentLink2Description: https://datasheet.ciiva.com/16096/1757255-16096404.pdf?src-supplier=Onlinecomponents.com; ComponentLink3URL: https://datasheet.ciiva.com/7630/1697152-7630840.pdf?src-supplier=Element14; ComponentLink3Description: https://datasheet.ciiva.com/7630/1697152-7630840.pdf?src-supplier=Element14; ComponentLink4URL: https://datasheet.ciiva.com/795/1757255-795421.pdf?src-supplier=Digi-Key; ComponentLink4Description: https://datasheet.ciiva.com/795/1757255-795421.pdf?src-supplier=Digi-Key; ComponentLink5URL: https://datasheet.ciiva.com/29210/569707-da-01-en-grundgehaeuse-1757255-250-st-29210878.pdf?src-supplier=Conrad; ComponentLink5Description: https://datasheet.ciiva.com/29210/569707-da-01-en-grundgehaeuse-1757255-250-st-29210878.pdf?src-supplier=Conrad; Supplier Part Number 1: 277-1107-ND
P1 P2 = CMP-2000-05536-1: Male Header, Pitch 2.54 mm, 1 x 6 Position, Height 10.67 mm, Tail Length 3.56 mm, 0 to 70 degC, RoHS, Bulk; Manufacturer: Molex; Pitch: 2.54mm; Mounting Angle: Vertical; Current Rating: 4A; Number of Positions / Contacts: 6; Voltage Rating: 250V; Packaging: Bulk; Package Description: Male Header, Pitch 2.54 mm, 1 x 6 Position, Height 10.67 mm, Tail Length 3.56 mm; Number of Rows: 1; Type: PinStrip; Contact Material: Brass; Product Category: .100K.K.Connectors; Factory Pack Quantity: 1000; Mounting Style: ThroughHole; RoHS: Details; Contact Plating: Tin; Housing Material: Nylon; Mounting Technology: ThroughHole; Termination Style: ThroughHole; Tradename: KK; Number of Positions: 6; Brand: Molex; Product Type: Headers; Series: 6373; Datasheet URL: https://datasheet.ciiva.com/19460/232303-19460895.pdf; Package Reference: 22-23-2061; Datasheet Version: Rev. P, 09/2001; Manufacturer URL: http://www.molex.com/
P3 P5-P7 = CMP-2000-05243-1: Male Header, Pitch 2.54 mm, 1 x 4 Position, Height 11.7 mm, Tail Length 3.56 mm, RoHS, Bulk; Manufacturer: Molex; Voltage rating: 250V; Current rating: 4A; Datasheet Version: Rev. F, 06/2009; Operating temperature: 0degCto+75degC; Contact material: Tinplatedbrass; Manufacturer URL: http://www.molex.com/; Housing material: Nylon(UL94V-0); Datasheet URL: http://www.molex.com/pdm_docs/sd/022272041_sd.pdf
P4 = CMP-2000-05538-1: Male Header, Pitch 2.54 mm, 1 x 3 Position, Height 11.7 mm, Tail Length 3.56 mm, -40 to 80 degC, RoHS, Bulk; Manufacturer: Molex; Voltage rating: 250V; Current rating: 4A; Package Reference: 22-27-2031; Housing material: Nylon(UL94V-0); Operating temperature: 0°Cto+75°C; Package Description: Male Header, Pitch 2.54 mm, 1 x 3 Position, Height 11.7 mm, Tail Length 3.56 mm; Package URL: http://www.molex.com/pdm_docs/sd/022272031_sd.pdf; Datasheet Version: 06/2016; Manufacturer URL: http://www.molex.com/; Mounting Technology: ThroughHole; Datasheet URL: http://www.molex.com/webdocs/datasheets/pdf/en-us/0022272031_PCB_HEADERS.pdf; Contact material: Tinplatedbrass

## Nets that join several sheets
5V: STM32 BOARD (TB1.51 TB1.52), POE+POWER+SERVO+CAMERA (J19.2), ARM+SERVO+I O (5 pins)
5V_SERVO: POE+POWER+SERVO+CAMERA (5 pins), ARM+SERVO+I O (J1.5 J1.9 J1.10)
12V: POE+POWER+SERVO+CAMERA (7 pins), ARM+SERVO+I O (P2.5)
GND: STM32 BOARD (10 pins), POE+POWER+SERVO+CAMERA (26 pins), ARM+SERVO+I O (13 pins)
ARM ENCODER 1: STM32 BOARD (TB1.5), ARM+SERVO+I O (J2.2)
ARM ENCODER 2: STM32 BOARD (TB1.7), ARM+SERVO+I O (J2.3)
ARM SERVO 1: STM32 BOARD (TB1.44), ARM+SERVO+I O (J1.2)
ARM SERVO 2: STM32 BOARD (TB1.43), ARM+SERVO+I O (J1.3)
ARM SERVO 3: STM32 BOARD (TB1.46), ARM+SERVO+I O (J1.4)
CAM SERVO 1: STM32 BOARD (TB1.78), POE+POWER+SERVO+CAMERA (J17.2)
CAM SERVO 2: STM32 BOARD (TB1.75), POE+POWER+SERVO+CAMERA (J16.2)
CAM SERVO 3: STM32 BOARD (TB1.9), POE+POWER+SERVO+CAMERA (J15.2)
CAM SERVO 4: STM32 BOARD (TB1.15), POE+POWER+SERVO+CAMERA (J14.2)
EMER RX: STM32 BOARD (TB1.86), ARM+SERVO+I O (P6.2)
EMER TX: STM32 BOARD (TB1.85), ARM+SERVO+I O (P6.1)
H1 GPIO1: STM32 BOARD (TB1.84), ARM+SERVO+I O (P5.2)
H1 GPIO2: STM32 BOARD (TB1.81), ARM+SERVO+I O (P5.4)
H2 GPIO1: STM32 BOARD (TB1.94), ARM+SERVO+I O (P7.2)
H2 GPIO2: STM32 BOARD (TB1.92), ARM+SERVO+I O (P7.4)
JETSON RX: STM32 BOARD (TB1.11), ARM+SERVO+I O (P3.2)
JETSON TX: STM32 BOARD (TB1.14), ARM+SERVO+I O (P3.1)
RST: STM32 BOARD (R2.1), ARM+SERVO+I O (P3.4 P6.4)
SABERTOOTH RX: STM32 BOARD (TB1.33), ARM+SERVO+I O (P1.4)
SABERTOOTH TX: STM32 BOARD (TB1.34), ARM+SERVO+I O (P1.3)
SMART ELEX RX: STM32 BOARD (TB1.19), ARM+SERVO+I O (P1.2)
SMART ELEX TX: STM32 BOARD (TB1.20), ARM+SERVO+I O (P1.1)
STATUS1: STM32 BOARD (TB1.95), ARM+SERVO+I O (P2.1)
STATUS2: STM32 BOARD (TB1.93), ARM+SERVO+I O (P2.2)
STATUS3: STM32 BOARD (TB1.91), ARM+SERVO+I O (P2.3)
TT_POT: STM32 BOARD (TB1.8), ARM+SERVO+I O (P4.2)